# EAGLE design MODULO GPS (EAGLE 9.6.2)
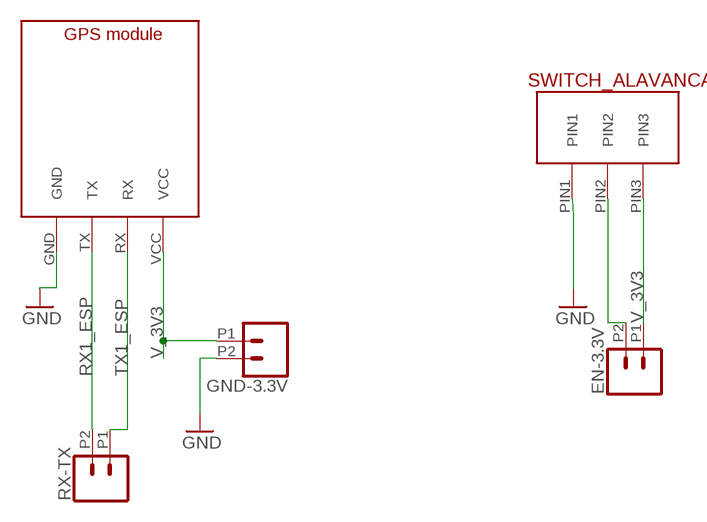
[diagram p0: schematic, sheet 1]

## Parts
EN-3.3V  CONN_022.54MM_SCREWTERM  [1X02_2.54_SCREWTERM]
GND-3.3V  CONN_022.54MM_SCREWTERM  [1X02_2.54_SCREWTERM]
RX-TX  CONN_022.54MM_SCREWTERM  [1X02_2.54_SCREWTERM]
U$1  SWITCH_ALAVANCA  [SWITCH_ALAVANCA_FOOTPRINT]
U$3  GPS_MODULE  [GPS_MODULE_FOOTPRINT]

## Nets
ENABLE_SIGNAL: EN-3.3V.P2 U$1.PIN2
GND: GND-3.3V.P2 U$1.PIN1 U$3.GND
RX1_ESP: RX-TX.P2 U$3.TX
TX1_ESP: RX-TX.P1 U$3.RX
V_3V3: EN-3.3V.P1 GND-3.3V.P1 U$1.PIN3 U$3.VCC

## Library data of the parts
EN-3.3V GND-3.3V RX-TX = SparkFun-Connectors:CONN_02: Multi connection point. Often used as Generic Header-pin footprint for 0.1 inch spaced/style header connections On any of the 0.1 inch spaced packages, you can populate with these: Break Away Headers - Straight <https://www.sparkfun.com/products/116> (PRT-00116) Break Away Male Headers - Right Angle <https://www.sparkfun.com/products/553> (PRT-00553) Female Headers <https://www.sparkfun.com/products/115> (PRT-00115) Break Away Headers - Machine Pin <https://www.sparkfun.com/products/117> (PRT-00117) Break Away Female Headers - Swiss Machine Pin <https://www.sparkfun.com/products/743> (PRT-00743) For SCREWTERMINALS and SPRING TERMINALS visit here: Screw Terimnals on SparkFun.com <https://www.sparkfun.com/search/results?term=Screw+Terminals> (5mm/3.5mm/2.54mm spacing) This device is also useful as a general connection point to wire up your design to another part of your project. Our various solder wires solder well into these plated through hole pads. Hook-Up Wire - Assortment (Stranded, 22 AWG) <https://www.sparkfun.com/products/11375> (PRT-11375) Hook-Up Wire - Assortment (Solid Core, 22 AWG) <https://www.sparkfun.com/products/11367> (PRT-11367) View the entire wire category on our website here <https://www.sparkfun.com/categories/141> Special notes: Molex polarized connector foot print use with: PRT-08233 with associated crimp pins and housings. 2.54_SCREWTERM for use with PRT-10571. 3.5mm Screw Terminal footprints for PRT-08084 5mm Screw Terminal footprints for use with PRT-08432
U$1 = CRD:SWITCH_ALAVANCA
U$3 = CRD:GPS_MODULE

## Board
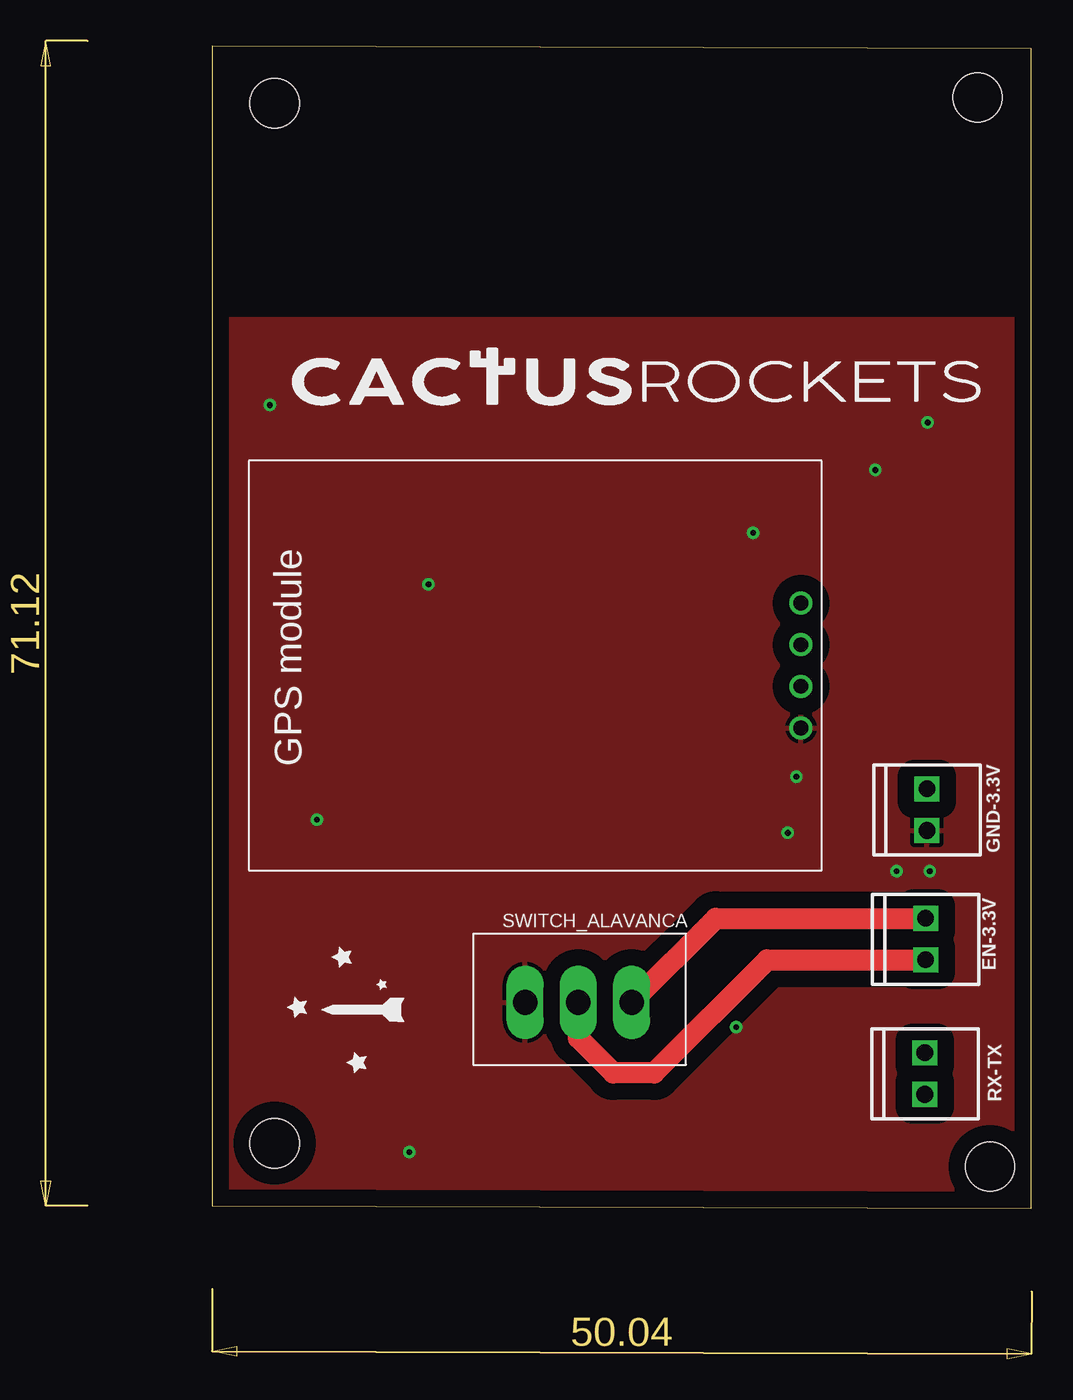
[diagram p1: board, top side]
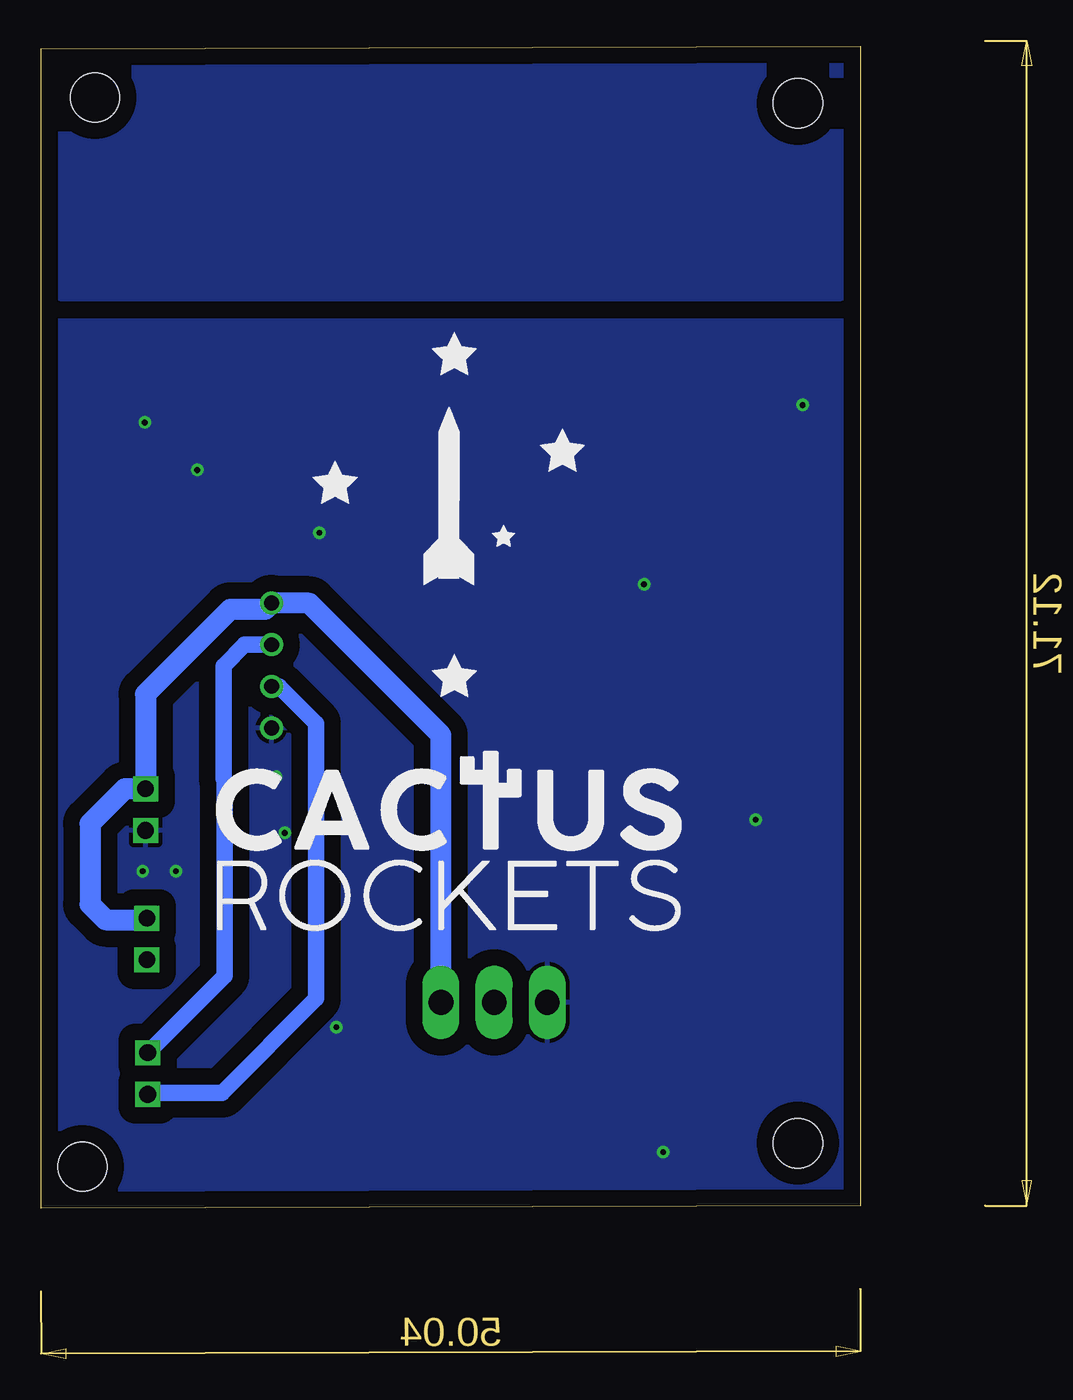
[diagram p2: board, bottom side, seen from below]

Size 50.02 x 70.94 mm. Coordinates in mm from the lower left corner, seen from the top.
Outline: 0,0.15 50.02,0 50.02,70.79 0,70.94 0,0.15
Copper layers (1*16): Top 0.035mm / dielectric 1.5mm / Bottom 0.035mm
Design rules "default *": minimum track width 1mm, minimum drill 0.35mm, track to track 40mil, track to pad 0.5mm, pad to pad 6mil, via to via 6mil, smd to smd 6mil, copper to edge 40mil, drill to drill 6mil, minimum pad ring 10mil, minimum via ring 8mil, stop-mask expansion 4mil, vias tented up to drill 1mm, thermal gap 10mil
Holes 3 mm at 3.81,67.46 3.81,3.96 47.5,2.54 46.74,67.82

### Footprints (pad centres in the part's own frame; a part is rotated, then mirrored left to right if it is on the bottom)
1X02_2.54_SCREWTERM = drill 1.016 square: P1 2.54,0; P2 0,0
SWITCH_ALAVANCA_FOOTPRINT = drill 1.5 long: PIN1 -3.302,-2.54; PIN2 -0.052,-2.54; PIN3 3.198,-2.54
GPS_MODULE_FOOTPRINT = drill 0.9: GND -4.01,-16.51; RX 1.07,-16.51; TX -1.47,-16.51; VCC 3.61,-16.51

### Placement (x,y rotation side)
EN-3.3V  43.57,15.16 90 top
GND-3.3V  43.65,23.06 90 top
RX-TX  43.52,6.95 90 top
U$1  22.41,15.1 0 top
U$3  19.45,33.33 90 top

### Tracks (layer width: path | path; a pad name or v marks a point on that pad's centre or on a via)
ANTENNA
  pour Bottom: 1.27,70 1.27,55.88 48.77,55.88 48.77,69.85
ENABLE_SIGNAL
  Top 1.27: EN-3.3V.P2 33.89,15.16 26.98,8.25 24.5,8.25 22.36,10.4 U$1.PIN2
GND  (via drill 0.35)
  other vias: 43.7,47.97 3.53,49.04 13.21,38.09 6.4,23.72 12.04,3.42 33.03,41.23 40.49,45.07 32,11.04 35.15,22.92 35.68,26.34 43.82,20.58 41.8,20.58
  pour Bottom: -0.05,54.19 -0.05,-0.21 50.28,-0.21 50.28,54.19
  pour Top: -0.03,54.24 -0.03,-0.21 50.26,-0.21 50.26,54.24
RX1_ESP
  Bottom 1: RX-TX.P2 43.42,7.05 38.98,7.05 33.23,12.8 33.23,29.61 35.49,31.86 U$3.TX
TX1_ESP
  Bottom 1: RX-TX.P1 38.81,14.19 38.81,26.13 38.88,26.2 38.88,33.11 37.59,34.4 U$3.RX
V_3V3
  Top 1.27: U$1.PIN3 30.75,17.7 EN-3.3V.P1
  Bottom 1.27: EN-3.3V.P1 43.66,17.61 46.09,17.61 47.04,18.56 47.04,23.48 44.91,25.6 GND-3.3V.P1 43.65,31.38 38.48,36.55 36.35,36.55 U$3.VCC 33.66,36.94 25.61,28.89 U$1.PIN3